# EAGLE schematic CameraController (EAGLE 6.5.0)
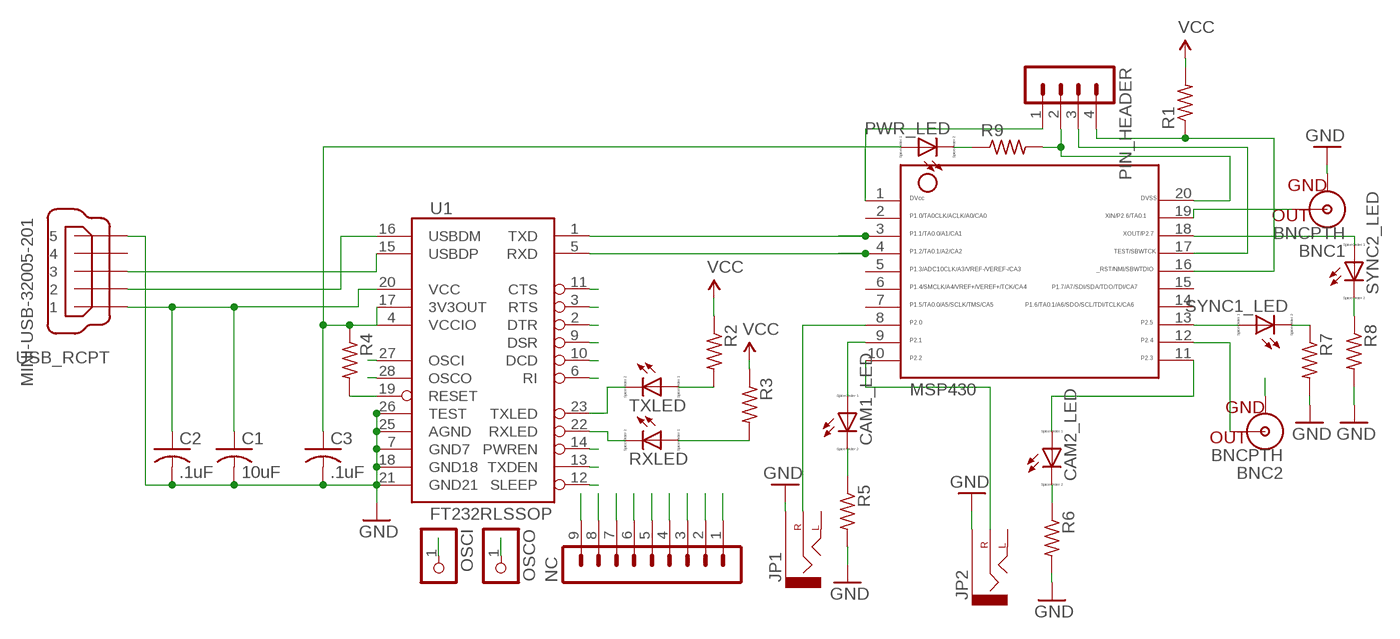
[diagram p0: schematic, sheet 1]

## Parts
BNC1  BNCPTH  [BNC]
BNC2  BNCPTH  [BNC]
C1  10uF  C-USC0805  [C0805]
C2  .1uF  C-USC0603  [C0603]
C3  .1uF  C-USC0603  [C0603]
CAM1_LED  LED_E  [LED_1206]
CAM2_LED  LED_E  [LED_1206]
JP1  AUDIO-JACKPTH  [AUDIO-JACK]
JP2  AUDIO-JACKPTH  [AUDIO-JACK]
MSP430  MSP430  [20_PIN]
NC  MA09-1  [MA09-1]
OSCI  PINHD-1X1  [1X01]
OSCO  PINHD-1X1  [1X01]
PIN_HEADER  MA04-1  [MA04-1]
PWR_LED  LED_E  [LED_1206]
R1  R-US_R1206  [R1206]
R2  R-US_R1206  [R1206]
R3  R-US_R1206  [R1206]
R4  R-US_R1206  [R1206]
R5  R-US_R1206  [R1206]
R6  R-US_R1206  [R1206]
R7  R-US_R1206  [R1206]
R8  R-US_R1206  [R1206]
R9  R-US_R1206  [R1206]
RXLED  LED_E  [LED_1206]
SYNC1_LED  LED_E  [LED_1206]
SYNC2_LED  LED_E  [LED_1206]
TXLED  LED_E  [LED_1206]
U1  FT232RLSSOP  [SSOP28DB]
USB_RCPT  MINI-USB-32005-201  [32005-201]

## Nets
3V3: C3.1 MSP430.1 PIN_HEADER.1 PWR_LED.A R4.1 U1.4(VCCIO) U1.17(3V3OUT)
CAM1: JP1.RING(RIGHT) MSP430.8
CAM1_LED: CAM1_LED.C R5.1
CAM2: JP2.RING(RIGHT) MSP430.10
CTS: NC.4 U1.11(CTS)
D+: U1.15(USBDP) USB_RCPT.3
D-: U1.16(USBDM) USB_RCPT.2
DCD: NC.5 U1.10(DCD)
DSR: NC.6 U1.9(DSR)
DTR: NC.9 U1.2(DTR)
GND: BNC1.GND BNC2.GND C1.2 C2.2 C3.2 JP1.SLEEVE JP2.SLEEVE MSP430.20 PIN_HEADER.2 R5.2 R6.2 R7.2 R8.2 R9.2 U1.7(GND7) U1.18(GND18) U1.21(GND21) U1.25(AGND) U1.26(TEST) USB_RCPT.5
LED1: CAM1_LED.A MSP430.9
LED2: CAM2_LED.A MSP430.11
N$1: R2.2 TXLED.A
N$2: RXLED.C U1.22(RXLED)
N$3: R3.2 RXLED.A
N$4: R4.2 U1.19(RESET)
N$5: CAM2_LED.C R6.1
N$6: MSP430.13 SYNC1_LED.A
N$7: R7.1 SYNC1_LED.C
N$8: MSP430.18 SYNC2_LED.A
N$9: R8.1 SYNC2_LED.C
N$10: PWR_LED.C R9.1
N$11: TXLED.C U1.23(TXLED)
OSCI: OSCI.1 U1.27(OSCI)
OSCO: OSCO.1 U1.28(OSCO)
PWREN: NC.1 U1.14(PWREN)
RI: NC.7 U1.6(RI)
RST: MSP430.16 PIN_HEADER.4 R1.1
RTS: NC.8 U1.3(RTS)
RXD: MSP430.4 U1.5(RXD)
SLEEP: NC.3 U1.12(SLEEP)
SYNC1: BNC2.S(OUT) MSP430.12
SYNC2: BNC1.S(OUT) MSP430.19
TEST: MSP430.17 PIN_HEADER.3
TXD: MSP430.3 U1.1(TXD)
TXDEN: NC.2 U1.13(TXDEN)
VCC: C1.1 C2.1 R1.2 R2.1 R3.1 U1.20(VCC) USB_RCPT.1
Unconnected: JP1.TIP(LEFT) JP2.TIP(LEFT) MSP430.2 MSP430.5 MSP430.6 MSP430.7 MSP430.14 MSP430.15 USB_RCPT.4

## Library data of the parts
BNC1 BNC2 = SparkFun-Connectors:BNC: BNC Connector, Mouser Part# 5227161
C1-C3 = CameraController:C-US: CAPACITOR, American symbol
CAM1_LED CAM2_LED PWR_LED RXLED SYNC1_LED SYNC2_LED TXLED = CameraController:LED_E: LED Source: http://www.osram.convergy.de Source: www.luxeon.com Source: www.kingbright.com; SPICEMODEL: NONE; SPICEPREFIX: D; SPICETYPE: diode
JP1 JP2 = CameraController:AUDIO-JACK: 3.5mm Audio Jack Simple 3.5mm common PCB mount audio jack. SKU: PRT-08032
MSP430 = BiphasicBoard:MSP430: MSP430 20 pins
NC = con-lstb:MA09-1: PIN HEADER; OC_FARNELL: unknown; OC_NEWARK: unknown
OSCI OSCO = BiphasicBoard:PINHD-1X1: PIN HEADER
PIN_HEADER = con-lstb:MA04-1: PIN HEADER; OC_FARNELL: unknown; OC_NEWARK: unknown
R1-R9 = BiphasicBoard:R-US_: RESISTOR, American symbol
U1 = SparkFun-DigitalIC:FT232RL: USB UART FT232RL 4th Generation USB UART (USB <-> Serial) Controller. Spark Fun Electronics SKU : COM-00650 Production SKU IC-00870; PROD_ID: IC-00870
USB_RCPT = con-cypressindustries:MINI-USB-: MINI USB-B Conector Source: www.cypressindustries.com; OC_FARNELL: unknown; OC_NEWARK: unknown